# EAGLE schematic MRCS-ATSN (EAGLE 7.7.0)
Dynamic/Electret Dispatcher/Operator board by Clint Gilliland
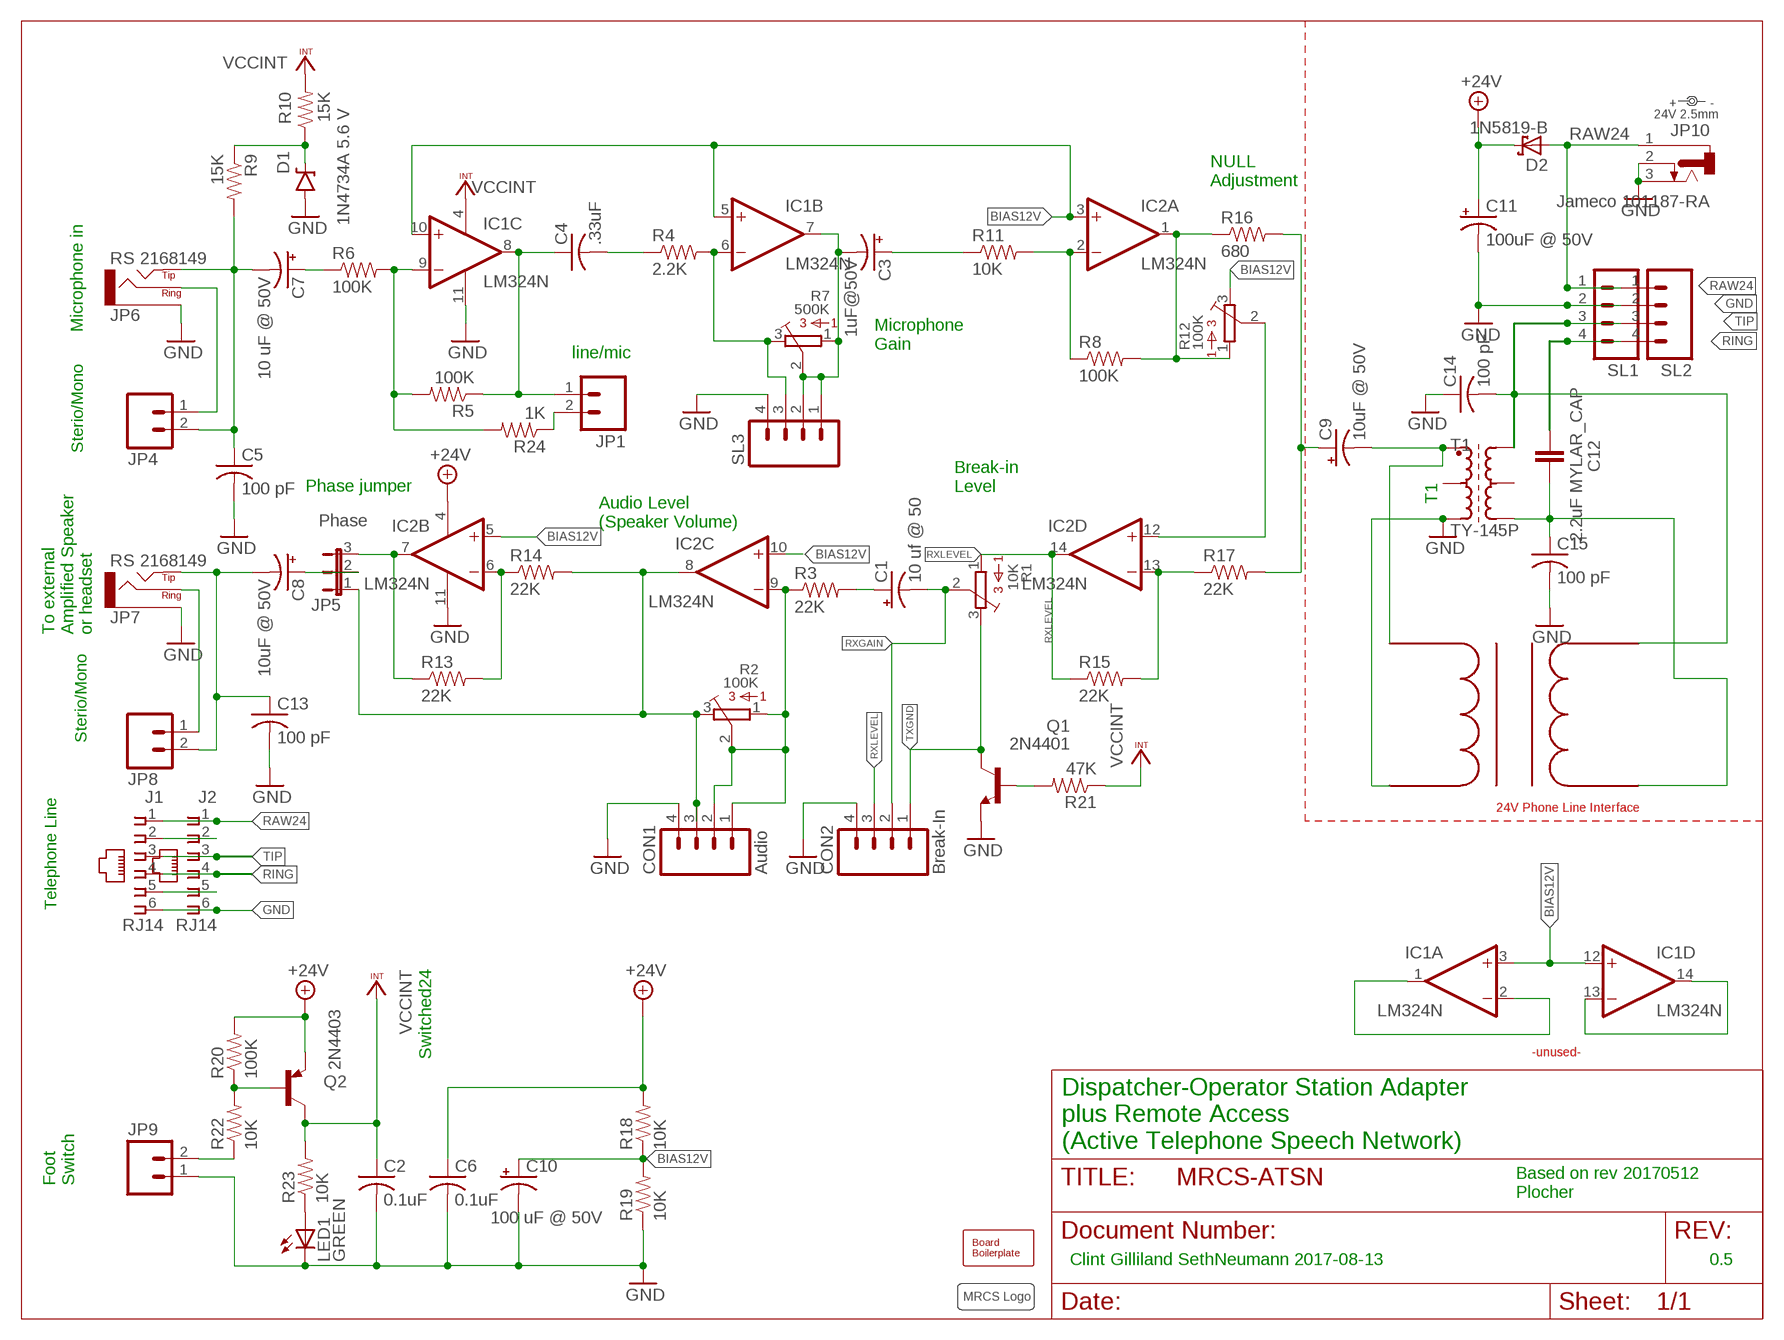
[diagram p0: schematic, sheet 1]

## Parts
BOARD1  BOARD69X100  BOARD69X160  [BOARD-DINRAIL-2.7IN-16CM]
C1  10 uf @ 50  CPOL-USE2-5  [E2-5]
C2  0.1uF  C-US025-030X050  [C025-030X050]
C3  1uF@50V  CPOL-USE2-5  [E2-5]
C4  .33uF  C-US050-050X075  [C050-050X075]
C5  100 pF  C-US050-025X075  [C050-025X075]
C6  0.1uF  C-US025-030X050  [C025-030X050]
C7  10 uF @ 50V  CPOL-USE2-5  [E2-5]
C8  10uF @ 50V  CPOL-USE2-5  [E2-5]
C9  10uF @ 50V  CPOL-USE2-5  [E2-5]
C10  100 uF @ 50V  CPOL-USE3.5-10  [E3.5-10]
C11  100uF @ 50V  CPOL-USE3.5-10  [E3.5-10]
C12  2.2uF MYLAR_CAP  C15/9  [C15B9]
C13  100 pF  C-US050-025X075  [C050-025X075]
C14  100 pF  C-US025-030X050  [C025-030X050]
C15  100 pF  C-US025-030X050  [C025-030X050]
CON1  Audio  CONNECTOR-M04LOCK  [1X04_LOCK]
CON2  Break-In  CONNECTOR-M04LOCK  [1X04_LOCK]
D1  1N4734A 5.6 V  DIODE-ZENERPTH  [DIODE-ZENER]
D2  1N5819-B  [DO41-7.6]
IC1  LM324N  [DIL14]
IC2  LM324N  [DIL14]
J1  RJ14  CONNECTOR-RJ25-43860-2-MOLEX  [RJ25-INVERTED]
J2  RJ14  CONNECTOR-RJ25-43860-2-MOLEX  [RJ25-INVERTED]
JP1  CONNECTOR-M021X02-LOCK  [1X02_LOCK]
JP4  CONNECTOR-M021X02-LOCK  [1X02_LOCK]
JP5  Phase  JUMPER-3PTH-LOCK  [1X03]
JP6  RS 2168149  CONNECTOR-AUDIO3.5MM-ADAMTECH  [AUDIO-JACK-3.5MM_STEREO]
JP7  RS 2168149  CONNECTOR-AUDIO3.5MM-ADAMTECH  [AUDIO-JACK-3.5MM_STEREO]
JP8  CONNECTOR-M021X02-LOCK  [1X02_LOCK]
JP9  CONNECTOR-M02508-LOCK  [MSTB2]
JP10  Jameco 101187-RA  CONNECTOR-DC-POWER-RA  [DCJ0202]
LED1  GREEN  LED3MM  [LED3MM]
POWER  24V 2.5mm  DOC-POWER_LABEL  [POWER_USAGE]
Q1  2N4401  29-NPN-TO92-EBC  [TO92-EBC]
Q2  2N4403  2N4126  [TO92-CBE]
R1  10K  3386-K  [3386K]
R2  100K  3386-K  [3386K]
R3  22K  RESISTORPTH-1/4W  [AXIAL-0.4]
R4  2.2K  RESISTORPTH-1/4W  [AXIAL-0.4]
R5  100K  RESISTORPTH-1/4W  [AXIAL-0.4]
R6  100K  RESISTORPTH-1/4W  [AXIAL-0.4]
R7  500K  3386-K  [3386K]
R8  100K  RESISTORPTH-1/4W  [AXIAL-0.4]
R9  15K  RESISTORPTH-1/4W  [AXIAL-0.4]
R10  15K  RESISTORPTH-1/4W  [AXIAL-0.4]
R11  10K  RESISTORPTH-1/4W  [AXIAL-0.4]
R12  100K  3386-K  [3386K]
R13  22K  RESISTORPTH-1/4W  [AXIAL-0.4]
R14  22K  RESISTORPTH-1/4W  [AXIAL-0.4]
R15  22K  RESISTORPTH-1/4W  [AXIAL-0.4]
R16  680  RESISTORPTH-1/4W  [AXIAL-0.4]
R17  22K  RESISTORPTH-1/4W  [AXIAL-0.4]
R18  10K  RESISTORPTH-1/4W  [AXIAL-0.4]
R19  10K  RESISTORPTH-1/4W  [AXIAL-0.4]
R20  100K  RESISTORPTH-1/4W  [AXIAL-0.4]
R21  47K  RESISTORPTH-1/4W  [AXIAL-0.4]
R22  10K  RESISTORPTH-1/4W  [AXIAL-0.4]
R23  10K  RESISTORPTH-1/4W  [AXIAL-0.4]
R24  1K  RESISTORPTH-1/4W  [AXIAL-0.4]
SL1  CONNECTOR-M04POLAR_LOCK  [MOLEX-1X4_LOCK]
SL2  CONNECTOR-M04POLAR_LOCK  [MOLEX-1X4_LOCK]
SL3  CONNECTOR-M04POLAR_LOCK  [MOLEX-1X4_LOCK]
T1  TY-145P  [TRANFORMER]
U$1  MRCS-LOGOBOT-LARGE  [MRCS-LOGO]
U$2  EI14_600-600  [XFMR580X500]

## Nets
+24V [Power]: C6.1 C11.+ D2.C IC2.4(P:V+) Q2.E R18.P$2 R20.P$2
BIAS12V [Power]: C10.+ IC1.5(B:+IN) IC1.10(C:+IN) IC2.3(A:+IN) IC2.5(B:+IN) IC2.10(C:+IN) R12.3 R18.P$1 R19.P$2
GND [Power]: C2.2 C5.2 C6.2 C10.- C11.- C13.2 C14.1 C15.2 CON1.4 CON2.4 D1.P$2(A) IC1.11(P:V-) IC2.11(P:V-) J1.6 J2.6 JP6.GND(SLEEVE) JP7.GND(SLEEVE) JP9.1 JP10.2 JP10.3 LED1.K(C) Q1.E R19.P$1 SL1.2 SL2.2 SL3.4 T1.3(E1) U$2.PBOTTOM
MICPOWER: D1.P$1(C) R9.P$1 R10.P$1
MICRING: JP4.1 JP6.RING
MICTIP: C5.1 C7.- JP4.2 JP6.TIP R9.P$2
N$1: C7.+ R6.P$1
N$2: IC1.1(A:OUT) IC1.2(A:-IN)
N$3: JP1.2 R24.P$1
N$4: IC1.3(A:+IN) IC1.12(D:+IN)
N$5: Q2.B R20.P$1 R22.P$2
N$6: IC1.9(C:-IN) R5.P$2 R6.P$2 R24.P$2
N$7: J1.2 J2.2
N$8: C1.+ R3.P$2
N$11: IC2.13(D:-IN) R15.P$2 R17.P$1
N$12: J1.5 J2.5
N$13: C3.- IC1.7(B:OUT) R7.1 R7.2 SL3.1 SL3.2
N$14: IC2.2(A:-IN) R8.P$1 R11.P$2
N$15: IC2.1(A:OUT) R8.P$2 R12.1 R16.P$1
N$16: JP9.2 R22.P$1
N$17: C3.+ R11.P$1
N$18: C4.1 IC1.8(C:OUT) JP1.1 R5.P$1
N$20: CON1.1 CON1.2 IC2.9(C:-IN) R2.1 R2.2 R3.P$1
N$21: LED1.A R23.P$1
N$24: IC2.12(D:+IN) R12.2
N$31: IC1.13(D:-IN) IC1.14(D:OUT)
N$32: C8.+ JP5.2
N$38: IC1.6(B:-IN) R4.P$2 R7.3 SL3.3
N$39: C4.2 R4.P$1
N$40: CON1.3 IC2.8(C:OUT) JP5.1 R2.3 R14.P$2
N$41: IC2.7(B:OUT) JP5.3 R13.P$1
N$43: IC2.6(B:-IN) R13.P$2 R14.P$1
Q1BASE: Q1.B R21.P$2
RAW24 [Power]: D2.A J1.1 J2.1 JP10.1 SL1.1 SL2.1
RING [PHONE]: C12.2 J1.4 J2.4 SL1.4 SL2.4
RING-ISOLATED [PHONE]: C12.1 C15.1 T1.4(E2) U$2.SBOTTOM
RXGAIN: C1.- CON2.2 R1.2
RXLEVEL: CON2.3 IC2.14(D:OUT) R1.1 R15.P$1
SPKRRING: JP7.RING JP8.1
SPKRTIP: C8.- C13.1 JP7.TIP JP8.2
TELCO-IN: C9.- T1.1(A1) U$2.PTOP
TELCO-IN-ISOLATED: C9.+ R16.P$2 R17.P$2
TIP [PHONE]: C14.2 J1.3 J2.3 SL1.3 SL2.3 T1.6(A2) U$2.STOP
TXGND: CON2.1 Q1.C R1.3
VCCINT [Power]: C2.1 IC1.4(P:V+) Q2.C R10.P$2 R21.P$1 R23.P$2
Unconnected: T1.2(C1) T1.5(C2)

## Notes on the sheet
- NULL
  Adjustment
- Microphone in
- Microphone
  Gain
- line/mic
- Sterio/Mono
- T1
- Phase jumper
- Break-in 
  Level
- Audio Level
  (Speaker Volume)
- To external
  Amplified Speaker
  or headset
- Sterio/Mono
- 24V Phone Line Interface
- Telephone Line
- Switched24 | -unused-
- Dispatcher-Operator Station Adapter
  plus Remote Access
  (Active Telephone Speech Network)
- Foot
  Switch
- Based on rev 20170512
  Plocher
- Clint Gilliland SethNeumann 2017-08-13 | 0.5

## Library data of the parts
BOARD1 = SPCoast:BOARD
C1 C3 C7-C11 = rcl:CPOL-US: POLARIZED CAPACITOR, American symbol
C2 C4-C6 C13-C15 = rcl:C-US: CAPACITOR, American symbol
C12 = capacitor-wima:C: CAPACITOR naming: grid - package width
CON1 CON2 = SPCoast 2017_04:CONNECTOR-M04: Header 4 Standard 4-pin 0.1" header. Use with straight break away headers (SKU : PRT-00116), right angle break away headers (PRT-00553), swiss pins (PRT-00743), machine pins (PRT-00117), and female headers (PRT-00115). Molex polarized connector foot print use with SKU : PRT-08231 with associated crimp pins and housings. 1MM SMD Version SKU: PRT-10208
D1 = SparkFun-DiscreteSemi:DIODE-ZENER: Zener Diode Production Part - 8199 3.4V Zener Voltage
D2 = diode:1N581*: 1.0A SCHOTTKY BARRIER RECTIFIER Source: http://www.diodes.com/datasheets/ds23001.pdf
IC1 IC2 = linear:LM324: OP AMP
J1 J2 = SPCoast:CONNECTOR-RJ25: AMP connector
JP1 JP4 JP8 JP9 = SPCoast:CONNECTOR-M02: PHOENIX CONNECTOR
JP5 = SPCoast:JUMPER-3
JP6 JP7 = SPCoast:CONNECTOR-AUDIO: 3.5mm Audio Jack Simple 3.5mm common PCB mount audio jack. SKU: PRT-08032
JP10 = SPCoast:CONNECTOR-DC-POWER: DC POWER JACK Source: DCJ0202.pdf
LED1 = SparkFun-LED:LED: LEDs Standard schematic elements and footprints for 5mm, 3mm, 1206, and 0603 sized LEDs. 5mm - Spark Fun Electronics SKU : COM-00529 (and others)
POWER = SPCoast:DOC-POWER_LABEL
Q1 = transistor:*-NPN-: NPN Transistror BF959 corrected 2008.03.06
Q2 = transistor-pnp:2N4126*: PNP Transistror
R1 R2 R7 R12 = bourns_test:3386-: 3386 Series 3/8" Square Trimmer
R3-R6 R8-R11 R13-R24 = SparkFun-Resistors:RESISTOR: Resistor Basic schematic elements and footprints for 0603, 1206, and PTH resistors.
SL1-SL3 = SPCoast:CONNECTOR-M04: Header 4 Standard 4-pin 0.1" header. Use with straight break away headers (SKU : PRT-00116), right angle break away headers (PRT-00553), swiss pins (PRT-00743), machine pins (PRT-00117), and female headers (PRT-00115). Molex polarized connector foot print use with SKU : PRT-08231 with associated crimp pins and housings. 1MM SMD Version SKU: PRT-10208
T1 = SPCoast:TY-145P
U$1 = SPCoast:MRCS-LOGO
U$2 = MRCSEI14:EI14_600-600: EI14 600-600 ohm coupling xfmr - non saturating

## Net classes
0 default: width 0.254 mm, clearance 0.254 mm
1 Power: width 0.406 mm, clearance 0.254 mm
2 PHONE: width 0.305 mm, clearance 0.381 mm